# EAGLE schematic transition_control_esp32 (EAGLE 9.5.2)
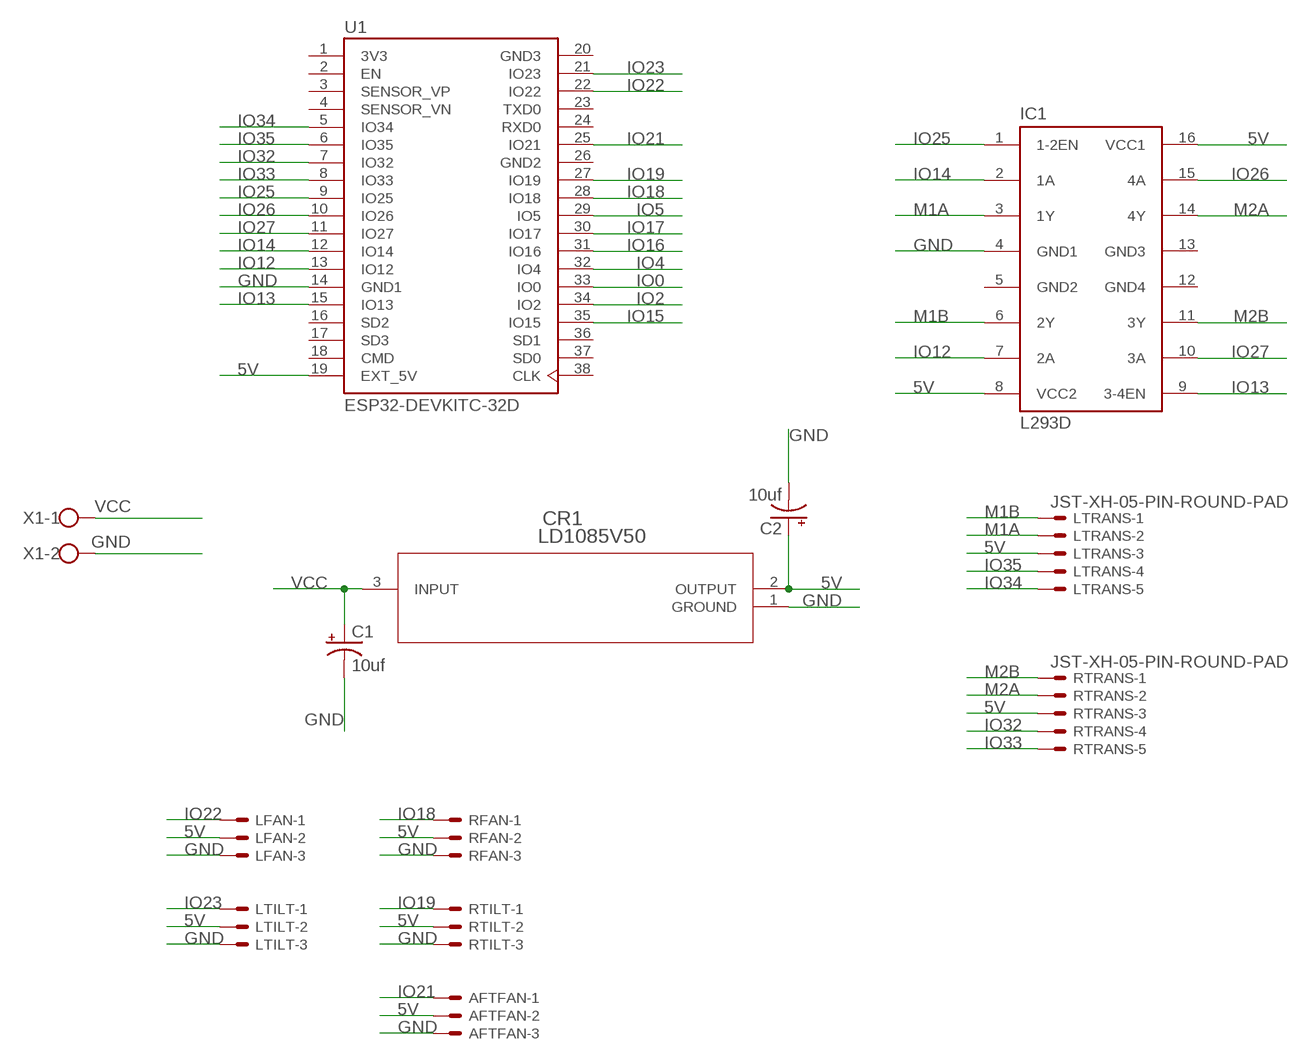
[diagram p0: schematic, sheet 1]

## Parts
AFTFAN  JST-XH-03-PIN-ROUND-PAD  [JST-XH-03-PACKAGE-ROUND-PAD]
C1  10uf  CPOL-USE2,5-6E  [E2,5-6E]
C2  10uf  CPOL-USE2,5-6E  [E2,5-6E]
CR1  LD1085V50  [TO-220]
IC1  L293D  [DIL16]
LFAN  JST-XH-03-PIN-ROUND-PAD  [JST-XH-03-PACKAGE-ROUND-PAD]
LTILT  JST-XH-03-PIN-ROUND-PAD  [JST-XH-03-PACKAGE-ROUND-PAD]
LTRANS  JST-XH-05-PIN-ROUND-PAD  [JST-XH-05-PACKAGE-ROUND-PAD]
RFAN  JST-XH-03-PIN-ROUND-PAD  [JST-XH-03-PACKAGE-ROUND-PAD]
RTILT  JST-XH-03-PIN-ROUND-PAD  [JST-XH-03-PACKAGE-ROUND-PAD]
RTRANS  JST-XH-05-PIN-ROUND-PAD  [JST-XH-05-PACKAGE-ROUND-PAD]
U1  ESP32-DEVKITC-32D  [MODULE_ESP32-DEVKITC-32D]
X1  W237-102  [W237-102]

## Nets
5V: AFTFAN.2 C2.+ CR1.2(OUTPUT) IC1.8(VCC2) IC1.16(VCC1) LFAN.2 LTILT.2 LTRANS.3 RFAN.2 RTILT.2 RTRANS.3 U1.19(EXT_5V)
GND: AFTFAN.3 C1.- C2.- CR1.1(GROUND) IC1.4(GND1) LFAN.3 LTILT.3 RFAN.3 RTILT.3 U1.14(GND1) X1.2
IO0: U1.33(IO0)
IO2: U1.34(IO2)
IO4: U1.32(IO4)
IO5: U1.29(IO5)
IO12: IC1.7(2A) U1.13(IO12)
IO13: IC1.9(3-4EN) U1.15(IO13)
IO14: IC1.2(1A) U1.12(IO14)
IO15: U1.35(IO15)
IO16: U1.31(IO16)
IO17: U1.30(IO17)
IO18: RFAN.1 U1.28(IO18)
IO19: RTILT.1 U1.27(IO19)
IO21: AFTFAN.1 U1.25(IO21)
IO22: LFAN.1 U1.22(IO22)
IO23: LTILT.1 U1.21(IO23)
IO25: IC1.1(1-2EN) U1.9(IO25)
IO26: IC1.15(4A) U1.10(IO26)
IO27: IC1.10(3A) U1.11(IO27)
IO32: RTRANS.4 U1.7(IO32)
IO33: RTRANS.5 U1.8(IO33)
IO34: LTRANS.5 U1.5(IO34)
IO35: LTRANS.4 U1.6(IO35)
M1A: IC1.3(1Y) LTRANS.2
M1B: IC1.6(2Y) LTRANS.1
M2A: IC1.14(4Y) RTRANS.2
M2B: IC1.11(3Y) RTRANS.1
VCC: C1.+ CR1.3(INPUT) X1.1
Unconnected: U1.2(EN) U1.3(SENSOR_VP) U1.4(SENSOR_VN) U1.16(SD2) U1.17(SD3) U1.18(CMD) U1.23(TXD0) U1.24(RXD0) U1.36(SD1) U1.37(SD0) U1.38(CLK)

## Power pins joined to a net without a drawn wire
3V3: U1.1(3V3)
GND2: IC1.5(GND2) U1.26(GND2)
GND3: IC1.13(GND3) U1.20(GND3)
GND4: IC1.12(GND4)

## Library data of the parts
AFTFAN LFAN LTILT RFAN RTILT = Rembrandt Electronics - JST XH Connectors v1-0:JST-XH-03-PIN: JST XH Connector 2 Pin Wire to board connector. Pitch: 2,54 mm, (0.100") Number of pins: 3 Created by Rembrandt Electronics www.rembrandtelectronics.com
C1 C2 = adafruit:CPOL-US: POLARIZED CAPACITOR, American symbol
CR1 = LD1085V50:LD1085V50; BUILT_BY: EMA_UL_Team; MANUFACTURER_PART_NUMBER: LD1085V50; VENDOR: STMicroelectronics
IC1 = st-microelectronics:L293D: PUSH-PULL 4 CHANNEL DRIVER; MPN: L293D; OC_FARNELL: 9589619; OC_NEWARK: 56P8249
LTRANS RTRANS = Rembrandt Electronics - JST XH Connectors v1-0:JST-XH-05-PIN: JST XH Connector 2 Pin Wire to board connector. Pitch: 2,54 mm, (0.100") Number of pins: 5 Created by Rembrandt Electronics www.rembrandtelectronics.com
U1 = ESP32-DEVKITC-32D:ESP32-DEVKITC-32D: Eval Board For Esp-Wroom-32; AVAILABILITY: Unavailable; DESCRIPTION: EVAL BOARD FOR ESP-WROOM-32; MF: Espressif Systems; MP: ESP32-DEVKITC-32D; PACKAGE: None; PRICE: None
X1 = con-wago-500:W237-102: WAGO SCREW CLAMP; MPN: 237-102; OC_FARNELL: unknown; OC_NEWARK: 70K9898